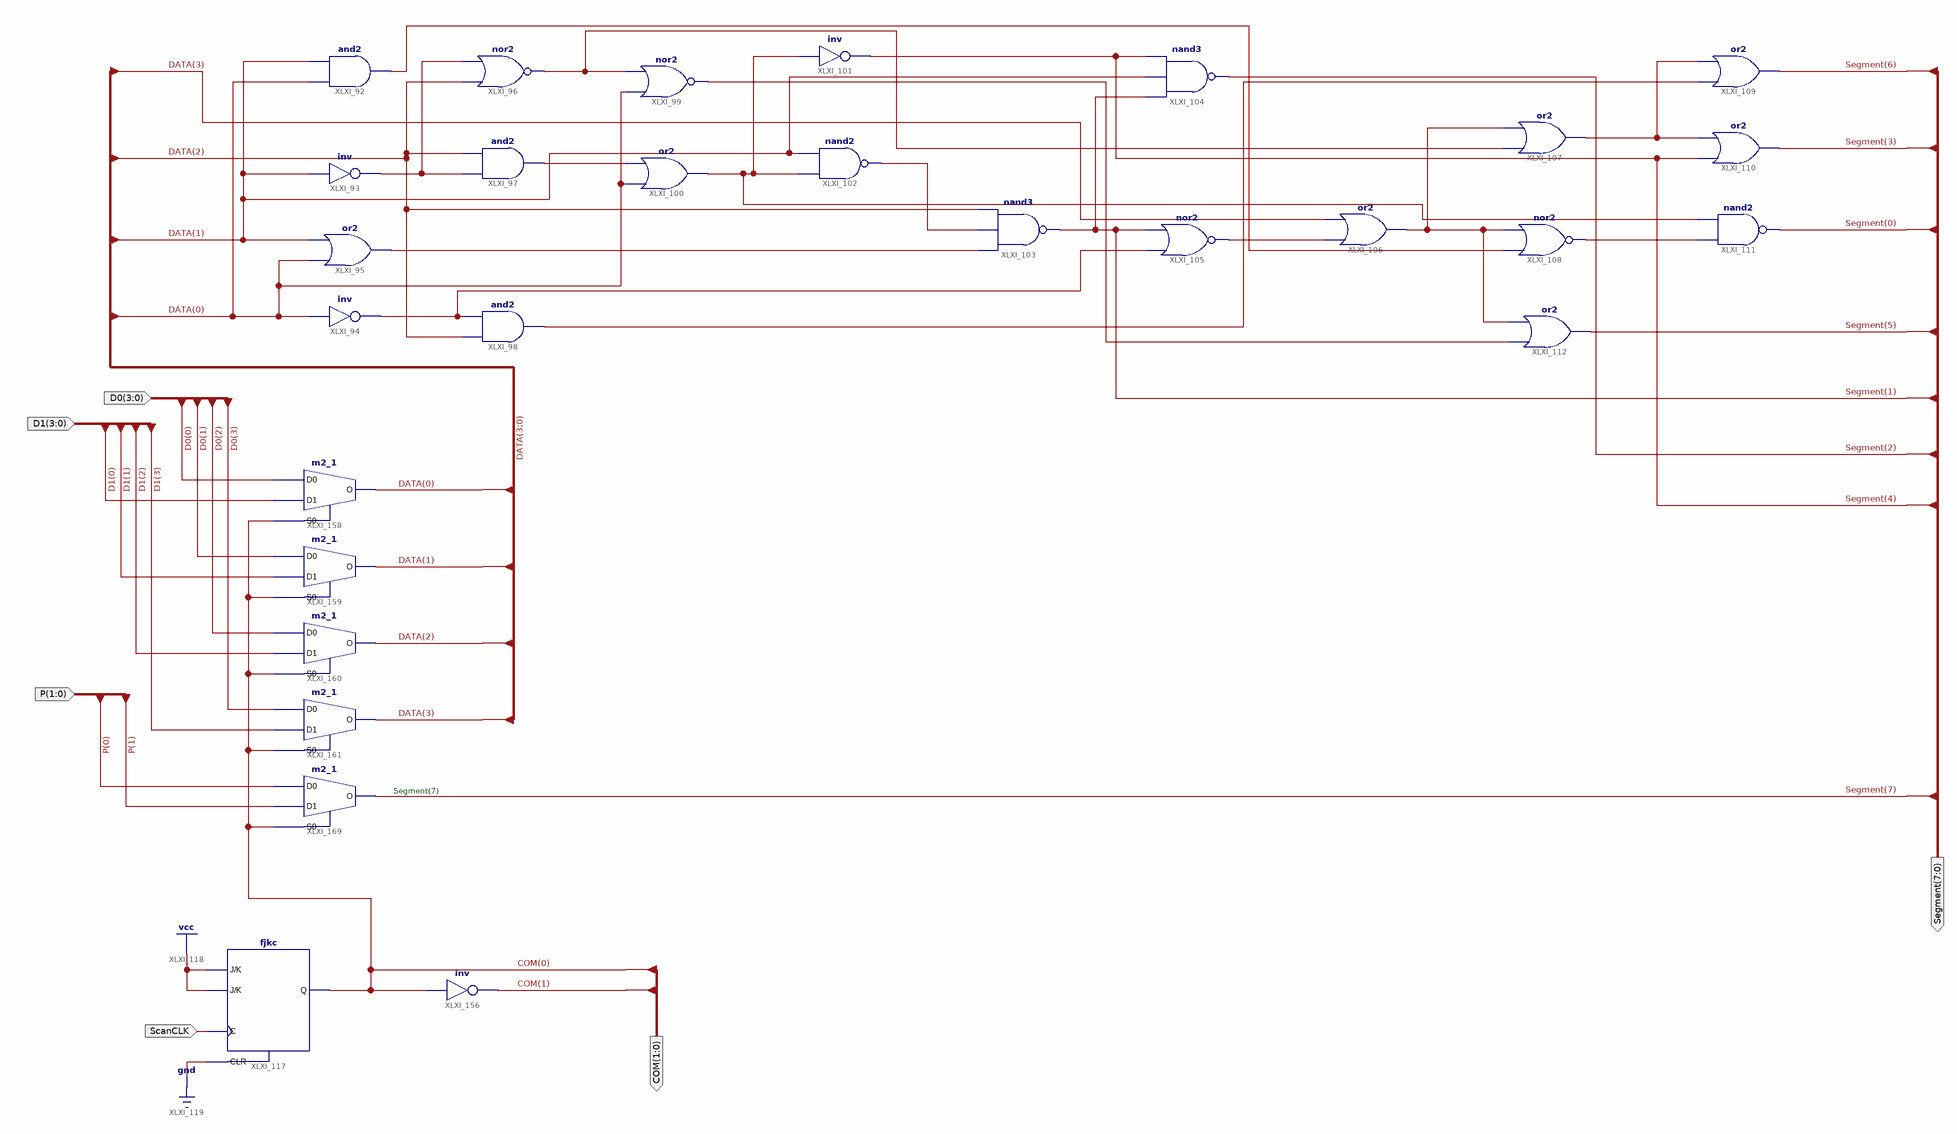
[diagram p0: schematic sheet 1]
// Xilinx ISE schematic ssd2d09bp.sch (spartan6) as structural Verilog: 28 symbols, 6 ports
module ssd2d09bp (
  input  [3:0] D1,
  input  [3:0] D0,
  input  ScanCLK,
  input  [1:0] P,
  output [7:0] Segment,
  output [1:0] COM
);

  wire XLXN_109, XLXN_111, XLXN_113, XLXN_114, XLXN_117, XLXN_118, XLXN_119, XLXN_125, XLXN_129, XLXN_130,
       XLXN_131, XLXN_132, XLXN_134, XLXN_135;
  wire [3:0] DATA;

  and XLXI_92 (XLXN_129, DATA[0], DATA[1]);
  not XLXI_93 (XLXN_109, DATA[1]);
  not XLXI_94 (XLXN_111, DATA[0]);
  or XLXI_95 (XLXN_118, DATA[0], DATA[1]);
  nor XLXI_96 (XLXN_113, DATA[2], XLXN_109);
  and XLXI_97 (XLXN_114, XLXN_109, DATA[2]);
  and XLXI_98 (XLXN_135, DATA[2], XLXN_111);
  nor XLXI_99 (XLXN_131, DATA[0], XLXN_113);
  or XLXI_100 (XLXN_117, DATA[0], XLXN_114);
  not XLXI_101 (Segment[4], XLXN_117);
  nand XLXI_102 (XLXN_119, XLXN_117, DATA[1]);
  nand XLXI_103 (Segment[1], XLXN_118, XLXN_119, DATA[2]);
  nand XLXI_104 (Segment[2], Segment[1], DATA[1], Segment[4]);
  nor XLXI_105 (XLXN_125, XLXN_111, Segment[1]);
  or XLXI_106 (XLXN_130, XLXN_125, DATA[3]);
  or XLXI_107 (XLXN_134, XLXN_113, XLXN_130);
  nor XLXI_108 (XLXN_132, XLXN_129, XLXN_130);
  or XLXI_109 (Segment[6], XLXN_135, XLXN_134);
  or XLXI_110 (Segment[3], Segment[4], XLXN_134);
  nand XLXI_111 (Segment[0], XLXN_132, XLXN_117);
  or XLXI_112 (Segment[5], XLXN_131, XLXN_130);
  m2_1 XLXI_158 (.D0(D0[0]), .D1(D1[0]), .S0(COM[0]), .O(DATA[0]));
  m2_1 XLXI_159 (.D0(D0[1]), .D1(D1[1]), .S0(COM[0]), .O(DATA[1]));
  m2_1 XLXI_160 (.D0(D0[2]), .D1(D1[2]), .S0(COM[0]), .O(DATA[2]));
  m2_1 XLXI_161 (.D0(D0[3]), .D1(D1[3]), .S0(COM[0]), .O(DATA[3]));
  not XLXI_156 (COM[1], COM[0]);
  fjkc XLXI_117 (.C(ScanCLK), .CLR(1'b0), .J(1'b1), .K(1'b1), .Q(COM[0]));
  m2_1 XLXI_169 (.D0(P[0]), .D1(P[1]), .S0(COM[0]), .O(Segment[7]));

  // Notes on the sheet:
  //   Segment(7)
endmodule
